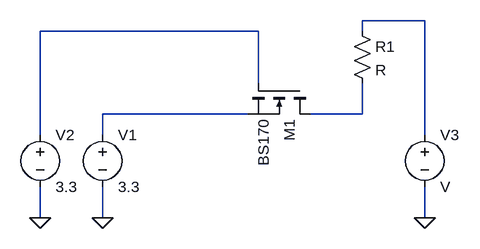
[diagram p0: schematic Draft7.asc]
Draft7.asc, the LTspice schematic file:
Version 4.1
SHEET 1 880 680
WIRE 480 64 384 64
WIRE 224 80 -112 80
WIRE 384 80 384 64
WIRE 224 160 224 80
WIRE 208 208 -16 208
WIRE 384 208 384 160
WIRE 384 208 304 208
WIRE -112 240 -112 80
WIRE -16 240 -16 208
WIRE 480 240 480 64
WIRE -112 368 -112 320
WIRE -16 368 -16 320
WIRE 480 368 480 320
FLAG 480 368 0
FLAG -16 368 0
FLAG -112 368 0
SYMBOL nmos 304 160 R90
SYMATTR InstName M1
SYMATTR Value BS170
SYMBOL res 368 64 R0
SYMATTR InstName R1
SYMBOL voltage -16 224 R0
WINDOW 123 0 0 Left 0
WINDOW 39 0 0 Left 0
SYMATTR InstName V1
SYMATTR Value 3.3
SYMBOL voltage -112 224 R0
WINDOW 123 0 0 Left 0
WINDOW 39 0 0 Left 0
SYMATTR InstName V2
SYMATTR Value 3.3
SYMBOL voltage 480 224 R0
SYMATTR InstName V3

The netlist it stands for:
* Draft7.asc
M1 N004 N002 N003 N003 BS170
R1 N001 N004 R
V1 N003 0 3.3
V2 N002 0 3.3
V3 N001 0 V
.model NMOS NMOS
.model PMOS PMOS
.lib standard.mos
.backanno
.end